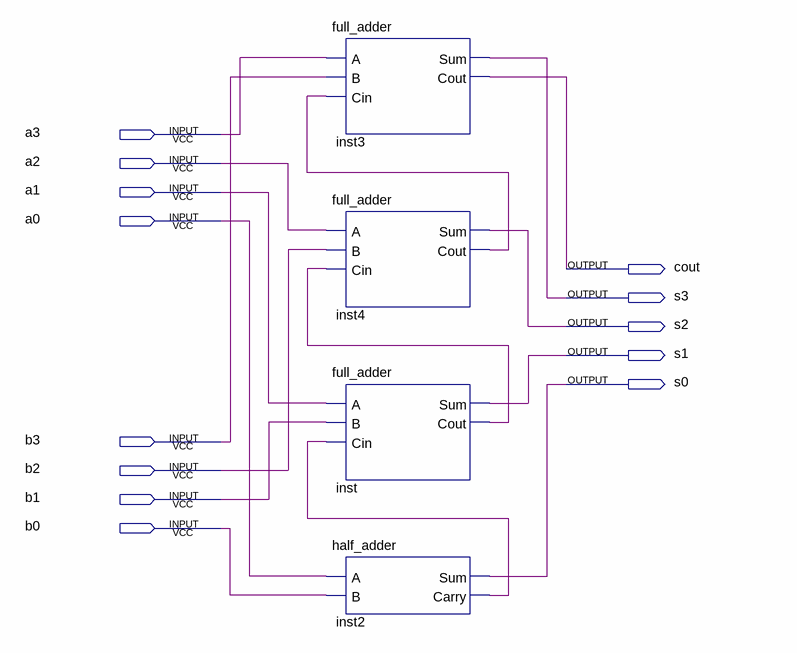
[diagram p0: schematic sheet]
// Quartus schematic example3.bdf as structural Verilog: 4 symbols, 13 pins
module example3 (
  input  a3,
  input  a2,
  input  a1,
  input  a0,
  input  b3,
  input  b2,
  input  b1,
  input  b0,
  output cout,
  output s3,
  output s2,
  output s1,
  output s0
);

  wire inst2_carry, inst4_cout, inst_cout;

  full_adder inst3 (.A(a3), .B(b3), .Cin(inst4_cout), .Sum(s3), .Cout(cout));
  full_adder inst4 (.A(a2), .B(b2), .Cin(inst_cout), .Sum(s2), .Cout(inst4_cout));
  full_adder inst (.A(a1), .B(b1), .Cin(inst2_carry), .Sum(s1), .Cout(inst_cout));
  half_adder inst2 (.A(a0), .B(b0), .Sum(s0), .Carry(inst2_carry));
endmodule
